# EasyEDA Pro project EasyEda_Node.eprj

# Schematic Schematic1
Board Name: Board1; Create Date: 2025-04-09; Page Name: P1; Project Name: New Project_2025-04-09_20-26-49; Schematic Name: Schematic1; Update Date: 2025-04-21; Company: EasyEDA.com; Page Size: A4; Version: V1.0
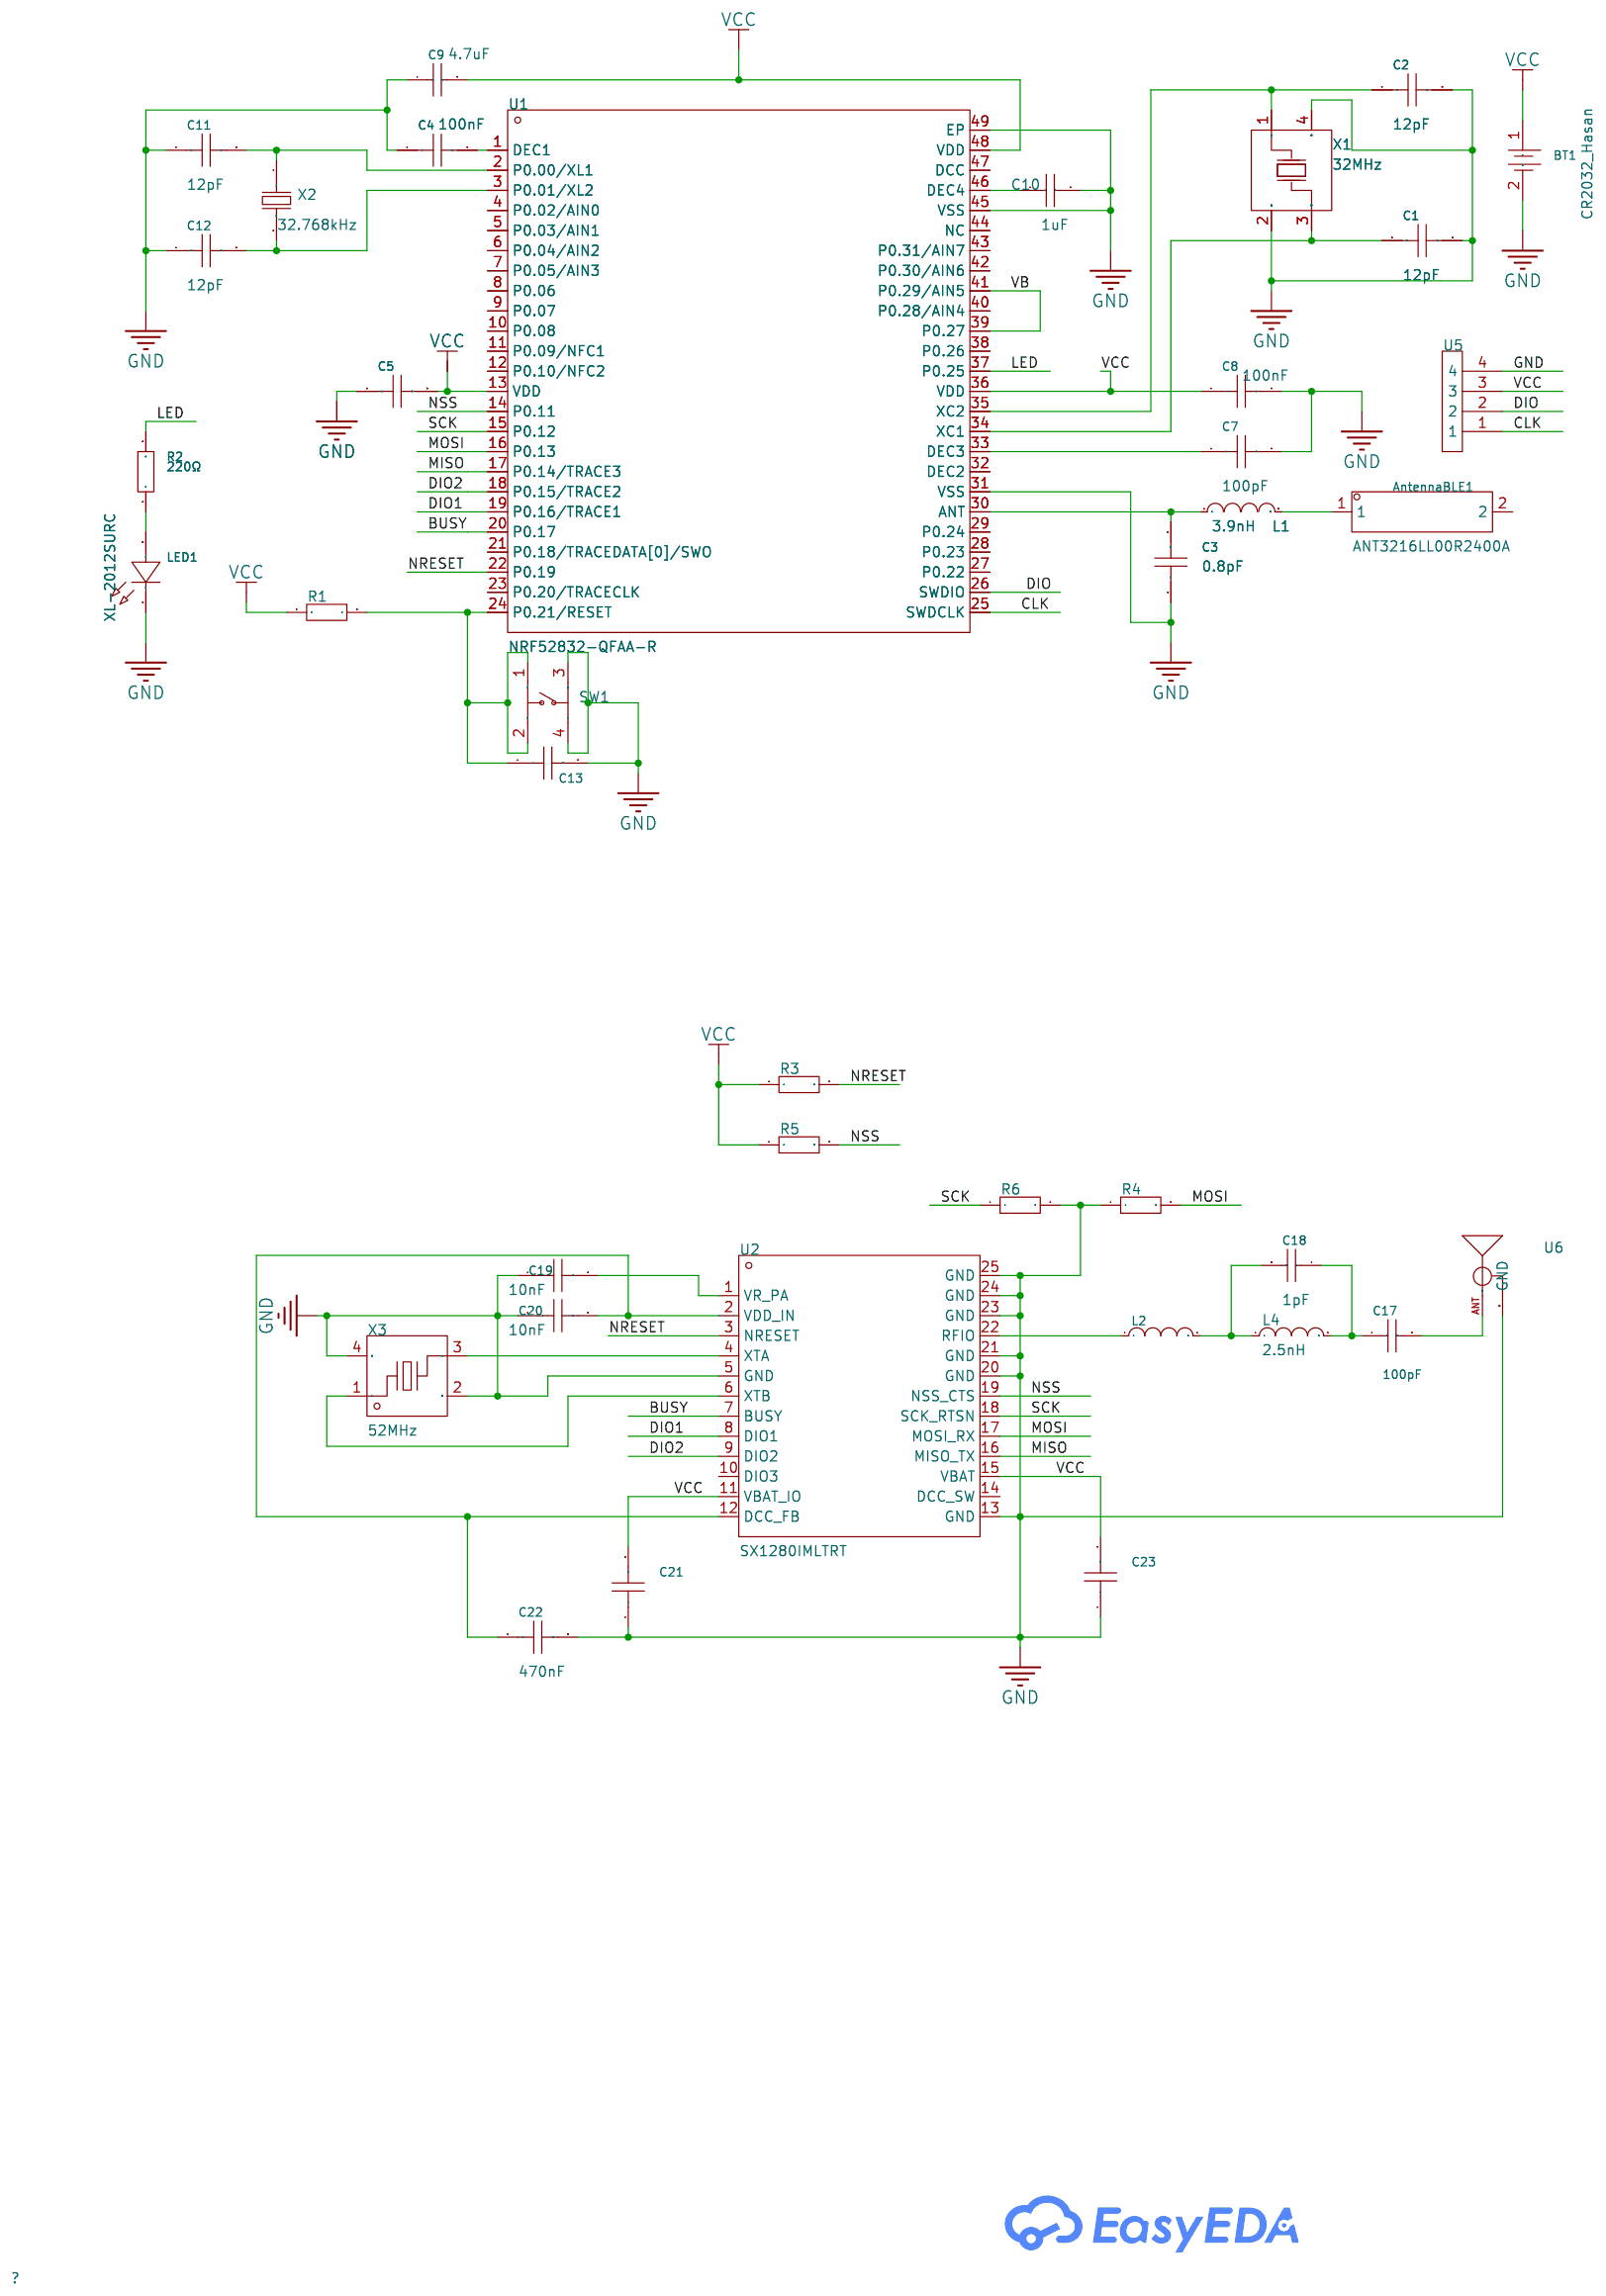
[diagram p0: schematic sheet]

## Parts
AntennaBLE1  ANT3216LL00R2400A  [ANT-SMD_L3.2-W1.6]
BT1  CR2032_Hasan  [CR2032_Hasan]
C1  12pF  [C0603]
C2  12pF  [C0603]
C3  0.8pF  [C0603]
C4  100nF  [C0603]
C5  100nF  [C0402]
C7  100pF  [C0603]
C8  100nF  [C0603]
C9  4.7uF  [C0603]
C10  1uF  [C0603]
C11  12pF  [C0603]
C12  12pF  [C0603]
C13  100nF  [C0402]
C17  100pF  [C0402]
C18  1pF  [C0402]
C19  10nF  [C0402]
C20  10nF  [C0402]
C21  100nF  [C0402]
C22  470nF  [C0402]
C23  100nF  [C0402]
L1  3.9nH  [L0402-RD]
L2  3nH  [L0402]
L4  2.5nH  [L0402]
LED1  XL-2012SURC  [LED0805-RD_RED]
R1  10kΩ  [R0402]
R2  220Ω  [R0603]
R3  10kΩ  [R0402]
R4  10kΩ  [R0402]
R5  10kΩ  [R0402]
R6  10kΩ  [R0402]
SW1  1TS026A-2300-0553-CT  [SW-SMD_4P-L2.6-W1.6-P0.75-LS3.0]
U1  NRF52832-QFAA-R  [QFN-48_L6.0-W6.0-P0.40-BL-EP3.8]
U2  SX1280IMLTRT  [QFN-24_L4.0-W4.0-P0.50-BL-EP2.6]
U5  -  [pogo_4p_passive_1.27]
U6  -  [Antenna_JLC_Tested]
X1  32MHz  [CRYSTAL-SMD_4P-L3.2-W2.5-BL]
X2  32.768kHz  [CRYSTAL-SMD_L3.2-W1.5]
X3  52MHz  [CRYSTAL-SMD_4P-L3.2-W2.5-BL]

## Library data of the parts
AntennaBLE1 = ANT3216LL00R2400A: Antenna Type:芯片天线 Central Frequency:2.45GHz Bandwidth:160MHz Peak Gain:5.05dBi Peak Gain:5.05dBi Polarization Type:Linear Impedance:50Ω Power capacity:1W VSWR:- Operating Temperature:-40℃~+105℃ Operating Temperature:-40℃~+105℃; LCSC Part Name: 无线组件陶瓷芯片天线; Supplier Part: C293767; Manufacturer: YAGEO(国巨); Supplier Footprint: 1206; Datasheet: https://atta.szlcsc.com/upload/public/pdf/source/20181012/C293767_CDE82A2F74DC82A94DB708CB53B68F23.pdf; Supplier: LCSC; Antenna Type: 芯片天线; Central Frequency: 2.45GHz; Bandwidth: 160MHz; Peak Gain: 5.05dBi; Polarization Type: Linear; Impedance: 50Ω; Power capacity: 1W; Operating Temperature: -40℃~+105℃
BT1 = CR2032_Holder: LCSC Part Name: CR2032弯脚电池片铜 3V; Supplier Part: C70373; Manufacturer: Q&amp;J; Supplier Footprint: SMD; JLCPCB Part Class: Extended Part; Datasheet: https://atta.szlcsc.com/upload/public/pdf/source/20160427/1461725216470.pdf; Supplier: LCSC; Connector Type: Battery button; Battery Type: CR2032
C1 C2 C11 C12 = CC0603FRNPO9BN120: Capacitance: Tolerance:±1% Tolerance:±1% Voltage Rated: Temperature Coefficient:; LCSC Part Name: 12pF ±1% 50V; Supplier Part: C519482; Manufacturer: YAGEO(国巨); Supplier Footprint: 0603; Datasheet: https://atta.szlcsc.com/upload/public/pdf/source/20200423/C519482_89049CE53433C44DEC6365B4D6A7EBAA.pdf; Supplier: LCSC; Tolerance: ±1%
C3 = CC0603CRNPO9BNR80: Capacitance: Voltage Rated: Temperature Coefficient:; LCSC Part Name: 0.8pF 50V; Supplier Part: C327165; Manufacturer: YAGEO(国巨); Supplier Footprint: 0603; Datasheet: https://atta.szlcsc.com/upload/public/pdf/source/20181031/C327165_24A4FA1353DDE2A290D154FA51B555EC.pdf; Supplier: LCSC
C4 C8 = CL10B104KB8NNNC: Capacitance: Tolerance:±10% Tolerance:±10% Voltage Rated: Temperature Coefficient:; LCSC Part Name: 100nF ±10% 50V; Supplier Part: C1591; Manufacturer: SAMSUNG(三星); Supplier Footprint: 0603; Datasheet: https://atta.szlcsc.com/upload/public/pdf/source/20160218/1457707763339.pdf; Supplier: LCSC; Tolerance: ±10%
C5 C13 C21 C23 = CC0402KRX7R7BB104: Capacitance: Tolerance:±10% Tolerance:±10% Voltage Rated: Temperature Coefficient:; LCSC Part Name: 100nF ±10% 16V; Supplier Part: C60474; Manufacturer: YAGEO(国巨); Supplier Footprint: 0402; JLCPCB Part Class: Extended Part; Datasheet: https://atta.szlcsc.com/upload/public/pdf/source/20211223/9278FD768280B81DDBEF48FA36411A03.pdf; Supplier: LCSC; Tolerance: ±10%
C7 = CC0603JRNPO9BN101: Capacitance: Tolerance:±5% Tolerance:±5% Voltage Rated: Temperature Coefficient:; LCSC Part Name: 100pF ±5% 50V; Supplier Part: C14665; Manufacturer: YAGEO(国巨); Supplier Footprint: 0603; Datasheet: https://atta.szlcsc.com/upload/public/pdf/source/20181008/C309499_21CC21451B82C39E3D92150FD6B30293.pdf; Supplier: LCSC; Tolerance: ±5%
C9 = CL10A475KP8NNNC: Capacitance: Tolerance:±10% Tolerance:±10% Voltage Rated: Temperature Coefficient:; LCSC Part Name: 4.7uF ±10% 10V; Supplier Part: C1705; Manufacturer: SAMSUNG(三星); Supplier Footprint: 0603; Datasheet: https://atta.szlcsc.com/upload/public/pdf/source/20160218/1457707763339.pdf; Supplier: LCSC; Tolerance: ±10%
C10 = CL10A105KO8NNNC: Capacitance: Tolerance:±10% Tolerance:±10% Voltage Rated: Temperature Coefficient:; LCSC Part Name: 1uF ±10% 16V; Supplier Part: C1592; Manufacturer: SAMSUNG(三星); Supplier Footprint: 0603; Datasheet: https://atta.szlcsc.com/upload/public/pdf/source/20220919/9FBE606BE0D9532D730F292EB26DC5BB.pdf; Supplier: LCSC; Tolerance: ±10%
C17 = GRM1555C1H101JA01D: Capacitance: Tolerance:±5% Tolerance:±5% Voltage Rated: Temperature Coefficient:; LCSC Part Name: 100pF ±5% 50V; Supplier Part: C77177; Manufacturer: muRata(村田); Supplier Footprint: 0402; JLCPCB Part Class: Extended Part; Datasheet: https://atta.szlcsc.com/upload/public/pdf/source/20161108/1478586482814.pdf; Supplier: LCSC; Tolerance: ±5%
C18 = GJM1555C1H1R0WB01D: Capacitance: Voltage Rated: Temperature Coefficient:; LCSC Part Name: 1pF 50V ±0.05pF; Supplier Part: C72134; Manufacturer: muRata(村田); Supplier Footprint: 0402; JLCPCB Part Class: Extended Part; Datasheet: https://atta.szlcsc.com/upload/public/pdf/source/20161108/1478586454732.pdf; Supplier: LCSC
C19 C20 = GRM155R71E103KA01D: Capacitance: Tolerance:±10% Tolerance:±10% Voltage Rated: Temperature Coefficient:; LCSC Part Name: 10nF ±10% 25V; Supplier Part: C77013; Manufacturer: muRata(村田); Supplier Footprint: 0402; Datasheet: https://atta.szlcsc.com/upload/public/pdf/source/20180326/C77013_E333CAB36C7BC33A0F4D36AE4B603ED6.pdf; Supplier: LCSC; Tolerance: ±10%
C22 = GRM155R61A474KE15D: Capacitance: Tolerance:±10% Tolerance:±10% Voltage Rated: Temperature Coefficient:; LCSC Part Name: 470nF ±10% 10V; Supplier Part: C77003; Manufacturer: muRata(村田); Supplier Footprint: 0402; Datasheet: https://atta.szlcsc.com/upload/public/pdf/source/20180326/C77003_446CEA12FBC0B60A315D36ABEF884933.pdf; Supplier: LCSC; Tolerance: ±10%
L1 = SDCL1005C3N9STDFM02: Inductance: Rated Current:- Saturation Current (Isat):- DC Resistance (DCR):- Q @ Freq:- Frequency - Self Resonant:- Ratings:; Supplier Part: C370223; Manufacturer: Sunlord(顺络); Supplier Footprint: 0402; Datasheet: https://atta.szlcsc.com/upload/public/pdf/source/20210916/2389196E6DC4CA1121B2D3610B126F46.pdf; Supplier: LCSC
L2 = LQW15AN3N0B80D: Inductance:3nH Rated Current: Saturation Current (Isat):- DC Resistance (DCR): Ratings:-; Supplier Part: C2041661; Manufacturer: muRata(村田); Supplier Footprint: 0402; JLCPCB Part Class: Extended Part; Datasheet: https://atta.szlcsc.com/upload/public/pdf/source/20210504/828CF85BF1F050871A8563B8C7472C90.pdf; Supplier: LCSC
L4 = LQW15AN2N5C00D: Inductance:2.5nH Rated Current: Saturation Current (Isat):- DC Resistance (DCR): Ratings:-; Supplier Part: C703121; Manufacturer: muRata(村田); Supplier Footprint: 0402; JLCPCB Part Class: Extended Part; Datasheet: https://atta.szlcsc.com/upload/public/pdf/source/20191022/C440248_094C93E028FCF0FA66FA57BC1ADCD3EF.pdf; Supplier: LCSC
LED1 = XL-2012SURC: Emitted Color:Red Power Dissipation:55mW Forward Current:25mA Dominant Wavelength:617nm~621nm Dominant Wavelength:617nm~621nm Peak Wavelength:623nm Lens Color:无色透明透镜 Color Temperature:- Color Temperature:- Viewing Angle:120° Mounting Sytle:Positive post O; Supplier Part: C965812; Manufacturer: XINGLIGHT(成兴光); Supplier Footprint: 0805; Datasheet: https://atta.szlcsc.com/upload/public/pdf/source/20221102/49E1A0A365644091E6270AF1C5E0FE37.pdf; Supplier: LCSC; Emitted Color: Red; Power Dissipation: 55mW; Forward Current: 25mA; Dominant Wavelength: 617nm~621nm; Peak Wavelength: 623nm; Lens Color: 无色透明透镜; Viewing Angle: 120°; Mounting Sytle: Positive post; Operating Temperature: -30℃~+85℃
R1 R4-R6 = RC0402FR-0710KL: Type:Thick Film Resistors Resistance: Tolerance: Power(Watts): Temperature Coefficient: Temperature Coefficient: Overload Voltage (Max): Operating Temperature Range: Operating Temperature Range:; LCSC Part Name: 10kΩ ±1%; Supplier Part: C60490; Manufacturer: YAGEO(国巨); Supplier Footprint: 0402; JLCPCB Part Class: Extended Part; Datasheet: https://atta.szlcsc.com/upload/public/pdf/source/20170606/1496716515432.pdf; Supplier: LCSC; Type: Thick Film Resistors
R2 = 0603WAF2200T5E: Type:Thick Film Resistors Resistance: Tolerance:±1% Tolerance:±1% Power(Watts): Overload Voltage (Max): Temperature Coefficient:±100ppm/℃ Temperature Coefficient:±100ppm/℃ Operating Temperature Range:-55℃~+155℃ Operating Temperature Range:-55℃~+155℃; LCSC Part Name: 220Ω ±1% 100mW 厚膜电阻; Supplier Part: C22962; Manufacturer: UNI-ROYAL(厚声); Supplier Footprint: 0603; Datasheet: https://atta.szlcsc.com/upload/public/pdf/source/20200306/C422600_1E6D84923E4A46A82E41ADD87F860B5C.pdf; Supplier: LCSC; Type: Thick Film Resistors; Tolerance: ±1%; Temperature Coefficient: ±100ppm/℃; Operating Temperature Range: -55℃~+155℃
R3 = RC0402FR-0710KL: Type:Thick Film Resistors Resistance: Tolerance:±1% Tolerance:±1% Power(Watts): Overload Voltage (Max): Temperature Coefficient:±100ppm/℃ Temperature Coefficient:±100ppm/℃ Operating Temperature Range:-55℃~+155℃ Operating Temperature Range:-55℃~+155℃; LCSC Part Name: 厚膜电阻 10kΩ ±1% 62.5mW; Supplier Part: C60490; Manufacturer: YAGEO(国巨); Supplier Footprint: 0402; JLCPCB Part Class: Extended Part; Datasheet: https://atta.szlcsc.com/upload/public/pdf/source/20170925/C131467_1506321478108990263.pdf; Supplier: LCSC; Type: Thick Film Resistors; Tolerance: ±1%; Temperature Coefficient: ±100ppm/℃; Operating Temperature Range: -55℃~+155℃
SW1 = 1TS026A-2300-0553-CT: Circuit:SPST Actuator Style:Round Button Operating Force:230gf Mounting Style:Brick nogging Switch Length:2.6mm Switch Width:1.6mm Switch Height:0.55mm Strike Gundam:不带 Contact Current:50mA Voltage Rating (DC):12V Power Rating:0.6W Insulation Resistance:1; LCSC Part Name: 2.6*1.6*0.55mm 立贴 轻触开关; Supplier Part: C913791; Manufacturer: HYP(鸿源精密); Supplier Footprint: SMD,1.6x2.6mm; JLCPCB Part Class: Extended Part; Datasheet: https://atta.szlcsc.com/upload/public/pdf/source/20210419/C913791_AF3AAAEB1C89AA41BE379EDBB7CBA7E3.pdf; Supplier: LCSC; Circuit: SPST; Actuator Style: Round Button; Operating Force: 230gf; Mounting Style: Brick nogging; Switch Length: 2.6mm; Switch Width: 1.6mm; Switch Height: 0.55mm; Strike Gundam: 不带; Contact Current: 50mA; Voltage Rating (DC): 12V; Power Rating: 0.6W; Insulation Resistance: 100MΩ; Actuator/Cap Color: Black; With Lamp: No; IP Rating: IP68; Pin Style: SMDSplicing; Mechanical Life: 20万次; Operating Temperature: -40℃~+90℃
U1 = NRF52832-QFAA-R: Frequency Range:- Frequency Range:- Interface:I2C,SPI,UART Operating Voltage:1.7V~3.6V Operating Voltage:1.7V~3.6V Applications:蓝牙；General-purposeISM>1GHz Output Power:4dBm Data Rate:2Mbps Current Of Transmitting:5.3mA Sensitivity:-96dBm Receive Current:5; Supplier Part: C77540; Manufacturer: NORDIC; Supplier Footprint: QFN-48-EP(6x6); Datasheet: https://atta.szlcsc.com/upload/public/pdf/source/20191122/C77540_B22384C9419DF4416C7889F27174782C.pdf; Supplier: LCSC; Interface: I2C,SPI,UART; Operating Voltage: 1.7V~3.6V; Applications: 蓝牙；General-purposeISM>1GHz; Output Power: 4dBm; Data Rate: 2Mbps; Current Of Transmitting: 5.3mA; Sensitivity: -96dBm; Receive Current: 5.4mA; Typical Application Frequency: 2.4GHz; Operating Temperature: -40℃~+85℃
U2 = SX1280IMLTRT: Frequency Range:2.4GHz Frequency Range:2.4GHz Interface:SPI,UART Operating Voltage:1.8V~3.7V Operating Voltage:1.8V~3.7V Applications:802.15.4 Output Power:12.5dBm Current Of Transmitting:24mA Sensitivity:-132dBm Receive Current:8.2mA Operating Temperatur; Supplier Part: C125969; Manufacturer: SEMTECH; Supplier Footprint: QFN-24-EP(4x4); Datasheet: https://atta.szlcsc.com/upload/public/pdf/source/20231031/F8C5ACEABB5B70646AFBC205A4D19EEC.pdf; Supplier: LCSC; Frequency Range: 2.4GHz; Interface: SPI,UART; Operating Voltage: 1.8V~3.7V; Applications: 802.15.4; Output Power: 12.5dBm; Current Of Transmitting: 24mA; Sensitivity: -132dBm; Receive Current: 8.2mA; Operating Temperature: -40℃~+85℃
U5 = pogo_4p_passive_1.27
U6 = Antenna_JLC_Tested
X1 = X322532MOB4SI: Crystal Type:SMD crystal oscillator Frequency: Normal temperature Frequency Tolerance:±10ppm Normal temperature Frequency Tolerance:±10ppm External load capacitor: Frequency Stability(Full temperature range):±20ppm Frequency Stability(Full temperature ran; LCSC Part Name: 32MHz ±10ppm 12pF; Supplier Part: C9009; Manufacturer: YXC(扬兴晶振); Supplier Footprint: SMD3225-4P; Datasheet: https://atta.szlcsc.com/upload/public/pdf/source/20240329/19D5F850207469550BEB00D7DFEDBC7A.pdf; Supplier: LCSC; Crystal Type: SMD crystal oscillator; Normal temperature Frequency Tolerance: ±10ppm; Frequency Stability(Full temperature range): ±20ppm
X2 = FC31M2-32.768-NTLNNDTL: Crystal Type:贴片晶振 Frequency: Normal temperature Frequency Tolerance:±10ppm Normal temperature Frequency Tolerance:±10ppm External load capacitor: Frequency Stability(Full temperature range):±10ppm Frequency Stability(Full temperature range):±10ppm Equival; LCSC Part Name: 32.768kHz ±10ppm 12.5pF; Supplier Part: C5120559; Manufacturer: HCI(杭晶); Supplier Footprint: SMD3215-2P; Datasheet: https://atta.szlcsc.com/upload/public/pdf/source/20220525/2E044CF849361D91E29045F083201687.pdf; Supplier: LCSC; Crystal Type: 贴片晶振; Normal temperature Frequency Tolerance: ±10ppm; Frequency Stability(Full temperature range): ±10ppm
X3 = SX3B52.000F1010F30: Crystal Type:贴片晶振 Frequency:52MHz Normal temperature Frequency Tolerance:±10ppm Normal temperature Frequency Tolerance:±10ppm External load capacitor: Frequency Stability(Full temperature range):±30ppm Frequency Stability(Full temperature range):±30ppm Eq; LCSC Part Name: 52MHz ±10ppm 10pF; Supplier Part: C7302019; Manufacturer: SCTF(星通时频); Supplier Footprint: SMD3225-4P; Datasheet: https://atta.szlcsc.com/upload/public/pdf/source/20230613/B877A30A0AA8EF1805C45A9E5426997D.pdf; Supplier: LCSC; Crystal Type: 贴片晶振; Normal temperature Frequency Tolerance: ±10ppm; Frequency Stability(Full temperature range): ±30ppm; Equivalent Series Resistance (ESR): 30Ω

## Nets
GND: BT1.2 C1.2 C2.2 C3.1 C4.1 C5.1 C7.2 C8.2 C9.1 C10.2 C11.1 C12.1 C13.2 C19.1 C20.1 C21.1 C22.2 C23.1 LED1.1(K) R4.1 R6.2 SW1.3 SW1.4 U1.31(VSS) U1.45(VSS) U1.49(EP) U2.5(GND) U2.13(GND) U2.20(GND) U2.21(GND) U2.23(GND) U2.24(GND) U2.25(GND) U5.4 U6.GND X1.2(GND) X1.4(GND) X3.2(GND) X3.4(GND)
VCC: BT1.1 C5.2 C8.1 C9.2 C21.2 C23.2 R1.1 R3.1 R5.1 U1.13(VDD) U1.36(VDD) U1.48(VDD) U2.11(VBAT_IO) U2.15(VBAT) U5.3
BUSY: U1.20(P0.17) U2.7(BUSY)
CLK: U1.25(SWDCLK) U5.1
DIO: U1.26(SWDIO) U5.2
DIO1: U1.19(P0.16/TRACE1) U2.8(DIO1)
DIO2: U1.18(P0.15/TRACE2) U2.9(DIO2)
LED: R2.2 U1.37(P0.25)
MISO: U1.17(P0.14/TRACE3) U2.16(MISO_TX)
MOSI: R4.2 U1.16(P0.13) U2.17(MOSI_RX)
NRESET: R3.2 U1.22(P0.19) U2.3(NRESET)
NSS: R5.2 U1.14(P0.11) U2.19(NSS_CTS)
SCK: R6.1 U1.15(P0.12) U2.18(SCK_RTSN)
VB: U1.39(P0.27) U1.41(P0.29/AIN5)
$1N1932: C12.2 U1.3(P0.01/XL2) X2.2
$1N1933: C4.2 U1.1(DEC1)
$1N1935: C11.2 U1.2(P0.00/XL1) X2.1
$1N1939: LED1.2(A) R2.1
$1N1940: C13.1 R1.2 SW1.1 SW1.2 U1.24(P0.21/RESET)
$1N1942: AntennaBLE1.1 L1.2
$1N1943: C10.1 U1.46(DEC4)
$1N1947: C7.1 U1.33(DEC3)
$1N1949: C2.1 U1.35(XC2) X1.1(OSC1)
$1N1952: L2.1 U2.22(RFIO)
$1N1953: C17.1 C18.1 L4.2
$1N1984: U2.4(XTA) X3.3
$1N1985: U2.6(XTB) X3.1
$1N2002: C1.1 U1.34(XC1) X1.3(OSC2)
$1N2004: C3.2 L1.1 U1.30(ANT)
$1N2009: C19.2 U2.1(VR_PA)
$1N2010: C20.2 C22.1 U2.2(VDD_IN) U2.12(DCC_FB)
$1N2029: C17.2 U6.ANT(SIGNAL)
$1N2030: C18.2 L2.2 L4.1

Not connected (* = marked no-connect by the designer): AntennaBLE1 2; U1 4(P0.02/AIN0) 5(P0.03/AIN1) 6(P0.04/AIN2) 7(P0.05/AIN3) 8(P0.06) 9(P0.07) 10(P0.08) 11(P0.09/NFC1) 12(P0.10/NFC2) 21(P0.18/TRACEDATA[0]/SWO) 23(P0.20/TRACECLK) 27(P0.22) 28(P0.23) 29(P0.24) 32(DEC2) 38(P0.26) 40(P0.28/AIN4) 42(P0.30/AIN6) 43(P0.31/AIN7) 44(NC) 47(DCC); U2 10(DIO3) 14(DCC_SW)

# Board PCB1
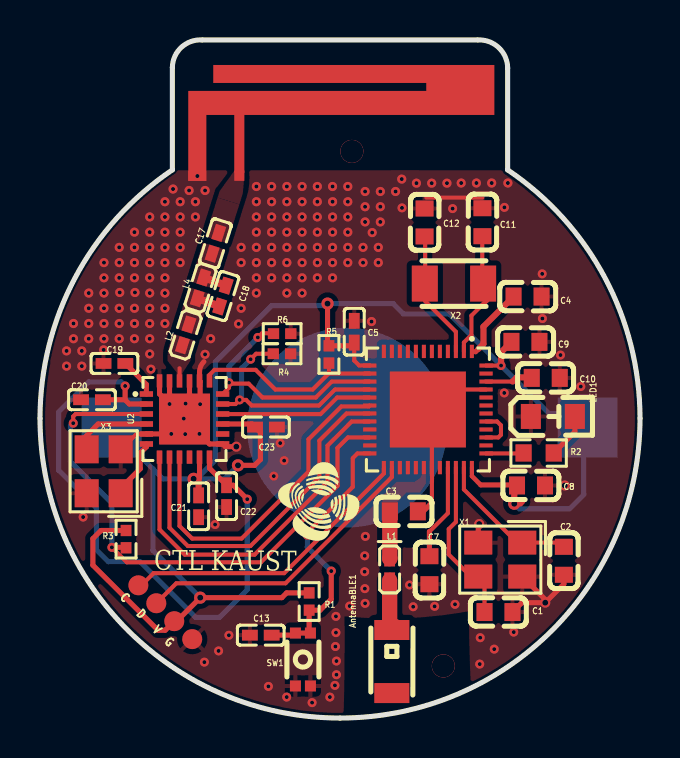
[diagram p1: board, top side]
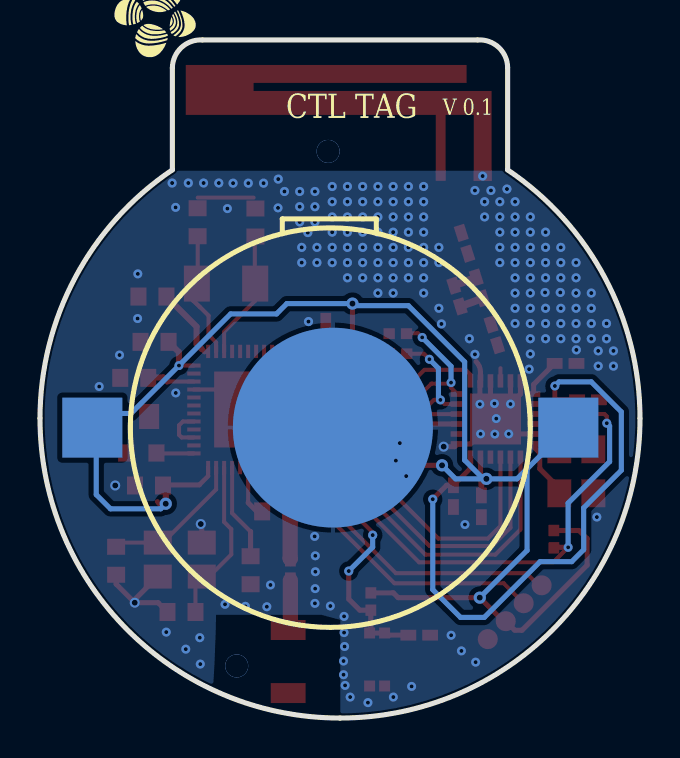
[diagram p2: board, bottom side, seen from below]

Outline 30 x 33.94 mm; copper layers: Top Layer, Bottom Layer. Coordinates in mm from the lower left corner of the outline.
Outline path: 0,15 arc(1.76,22.05) 6.62,27.44 6.62,32.56 arc(7.07,33.58) 8.12,33.94 21.88,33.94 arc(22.93,33.56) 23.38,32.54 23.38,27.44 arc(28.24,22.05) 30,15 arc(25.61,4.39) 15,0 arc(4.39,4.39) 0,15
Stack: Top Layer 0.035mm / Dielectric1 1.51mm FR4 er 4.5 / Bottom Layer 0.035mm

## Design rules (mm)
template: Custom Config
spacing copperThickness1oz (default): track to track 0.102, other pairs 0.152 to 0.279
spacing copperThickness2oz: track to track 0.203, other pairs 0.152 to 0.3
track width copperThickness1oz (default): min 0.127, default 0.254, max 2.54
track width copperThickness2oz: min 0.203, default 0.254, max 2.54
differential pair differentialPair (default): width min 0.127, default 0.254, max 2.54; gap min 0.152, default 0.152
via viaSize (default): diameter min 0.432, default 0.61, max 10; hole min 0.191, default 0.305, max 6.299
net GND uses Antenna
pour e1770 uses Antenna

## Placement (name value [footprint] x y rotation side)
AntennaBLE1  ANT3216LL00R2400A  [ANT-SMD_L3.2-W1.6]  17.59 2.83 270 top
BT1  -  [CR2032_Hasan]  15.48 14.54 270 bottom
C1  12pF  [C0603]  22.93 5.31 0 top
C2  12pF  [C0603]  26.19 7.87 270 top
C3  0.8pF  [C0603]  18.19 10.35 180 top
C4  100nF  [C0603]  24.38 21.1 180 top
C5  100nF  [C0402]  15.71 19.34 270 top
C7  100pF  [C0603]  19.47 7.4 270 top
C8  100nF  [C0603]  24.55 11.64 0 top
C9  4.7uF  [C0603]  24.27 18.83 180 top
C10  1uF  [C0603]  25.29 17.03 0 top
C11  12pF  [C0603]  22.12 24.82 270 top
C12  12pF  [C0603]  19.23 24.81 270 top
C13  100nF  [C0402]  11.04 4.15 180 top
C17  100pF  [C0402]  8.77 23.76 72.5 top
C18  1pF  [C0402]  9.15 21.12 252.5 top
C19  10nF  [C0402]  3.72 17.75 0 top
C20  10nF  [C0402]  2.6 15.93 0 top
C21  100nF  [C0402]  7.93 10.6 90 top
C22  470nF  [C0402]  9.33 11.11 270 top
C23  100nF  [C0402]  11.3 14.57 180 top
L1  3.9nH  [L0402-RD]  17.48 7.44 270 top
L2  3nH  [L0402]  7.28 19.18 72.5 top
L4  2.5nH  [L0402]  8.02 21.53 72.5 top
LED1  XL-2012SURC  [LED0805-RD_RED]  25.64 15.1 0 top
R1  10kΩ  [R0402]  13.46 5.83 270 top
R2  220Ω  [R0603]  24.93 13.27 180 top
R3  10kΩ  [R0402]  4.3 8.95 270 top
R4  10kΩ  [R0402]  12.1 18.24 180 top
R5  10kΩ  [R0402]  14.45 18.2 270 top
R6  10kΩ  [R0402]  12.11 19.24 0 top
SW1  1TS026A-2300-0553-CT  [SW-SMD_4P-L2.6-W1.6-P0.75-LS3.0]  13.15 2.93 270 top
U1  NRF52832-QFAA-R  [QFN-48_L6.0-W6.0-P0.40-BL-EP3.8]  19.39 15.44 180 top
U2  SX1280IMLTRT  [QFN-24_L4.0-W4.0-P0.50-BL-EP2.6]  7.23 14.97 270 top
U5  -  [pogo_4p_passive_1.27]  6.26 5.3 45 top
U6  -  [Antenna_JLC_Tested]  7.41 26.89 0 top
X1  32MHz  [CRYSTAL-SMD_4P-L3.2-W2.5-BL]  23.01 7.93 180 top
X2  32.768kHz  [CRYSTAL-SMD_L3.2-W1.5]  20.7 21.75 180 top
X3  52MHz  [CRYSTAL-SMD_4P-L3.2-W2.5-BL]  3.18 12.35 90 top

## Footprints (pads in the part's own frame, mm; a bottom-side part is the same pattern mirrored in y, then rotated)
ANT-SMD_L3.2-W1.6
  rect 1x1.75 smd: 1(-1.578,0) 2(1.578,0)
Antenna_JLC_Tested
  rect 0.5x0.1 smd: ANT(2.55,0.45)
  rect 0.9x0.5 smd: GND(0.45,0.25)
C0402
  rect 0.79x0.54 smd: 1(-0.545,0) 2(0.545,0)
C0603
  rect 0.8x0.9 smd: 1(-0.7,0) 2(0.7,0)
CR2032_Hasan
  rect 3x3 smd: 1(0,-11.9) 1(0,11.9)
  round 10 smd: 2(0,0.127)
CRYSTAL-SMD_4P-L3.2-W2.5-BL
  rect 1.4x1.2 smd: 1(-1.1,-0.85) 2(1.1,-0.85) 3(1.1,0.85) 4(-1.1,0.85)
CRYSTAL-SMD_L3.2-W1.5
  rect 1.3x1.8 smd: 1(-1.458,0) 2(1.458,0)
L0402
  rect 0.79x0.54 smd: 1(-0.545,0) 2(0.545,0)
L0402-RD
  rect 0.79x0.54 smd: 1(-0.545,0) 2(0.545,0)
LED0805-RD_RED
  rect 1x1.25 smd: 1(-1.1,0) 2(1.1,0)
pogo_4p_passive_1.27
  round 1 smd: 1(0,1.905) 2(0,0.635) 3(0,-0.635) 4(0,-1.905)
QFN-24_L4.0-W4.0-P0.50-BL-EP2.6
  rect 0.28x0.665 smd: 1(-1.25,-1.907) 2(-0.75,-1.907) 3(-0.25,-1.907) 4(0.25,-1.907) 5(0.75,-1.907) 6(1.25,-1.907) 13(1.25,1.907) 14(0.75,1.907) 15(0.25,1.907) 16(-0.25,1.907) 17(-0.75,1.907) 18(-1.25,1.907)
  rect 0.665x0.28 smd: 7(1.907,-1.25) 8(1.907,-0.75) 9(1.907,-0.25) 10(1.907,0.25) 11(1.907,0.75) 12(1.907,1.25) 19(-1.907,1.25) 20(-1.907,0.75) 21(-1.907,0.25) 22(-1.907,-0.25) 23(-1.907,-0.75) 24(-1.907,-1.25)
  rect 2.55x2.55 smd: 25(0,0)
QFN-48_L6.0-W6.0-P0.40-BL-EP3.8
  rect 0.2x0.665 smd: 1(-2.2,-2.908) 2(-1.8,-2.908) 3(-1.4,-2.908) 4(-1,-2.908) 5(-0.6,-2.908) 6(-0.2,-2.908) 7(0.2,-2.908) 8(0.6,-2.908) 9(1,-2.908) 10(1.4,-2.908) 11(1.8,-2.908) 12(2.2,-2.908) 25(2.2,2.908) 26(1.8,2.908) 27(1.4,2.908) 28(1,2.908) 29(0.6,2.908) 30(0.2,2.908) 31(-0.2,2.908) 32(-0.6,2.908) 33(-1,2.908) 34(-1.4,2.908) 35(-1.8,2.908) 36(-2.2,2.908)
  rect 0.665x0.2 smd: 13(2.908,-2.2) 14(2.908,-1.8) 15(2.908,-1.4) 16(2.908,-1) 17(2.908,-0.6) 18(2.908,-0.2) 19(2.908,0.2) 20(2.908,0.6) 21(2.908,1) 22(2.908,1.4) 23(2.908,1.8) 24(2.908,2.2) 37(-2.908,2.2) 38(-2.908,1.8) 39(-2.908,1.4) 40(-2.908,1) 41(-2.908,0.6) 42(-2.908,0.2) 43(-2.908,-0.2) 44(-2.908,-0.6) 45(-2.908,-1) 46(-2.908,-1.4) 47(-2.908,-1.8) 48(-2.908,-2.2)
  rect 3.8x3.8 smd: 49(0,0)
R0402
  rect 0.566x0.54 smd: 1(-0.433,0) 2(0.433,0)
R0603
  rect 0.806x0.864 smd: 1(-0.753,0) 2(0.753,0)
SW-SMD_4P-L2.6-W1.6-P0.75-LS3.0
  rect 0.55x0.55 smd: 1(-1.325,0.375) 2(-1.325,-0.375) 3(1.325,0.375) 4(1.325,-0.375)

## Nets
As in the schematic.

Pads without a net: AntennaBLE1 2; U1 4 5 6 7 8 9 10 11 12 21 23 27 28 29 32 38 40 42 43 44 47; U2 10 14

## Via types
v1: diameter 1.152, hole 1.152, Top Layer to Bottom Layer, 2 vias
v2: diameter 0.457, hole 0.203, Top Layer to Bottom Layer, 144 vias
v3: diameter 0.45, hole 0.2, Top Layer to Bottom Layer, 53 vias
v4: diameter 0.5, hole 0.3, Top Layer to Bottom Layer, 4 vias
v5: diameter 0.61, hole 0.305, Top Layer to Bottom Layer, 5 vias
v6: diameter 0.45, hole 0.201, Top Layer to Bottom Layer, 2 vias

## Routing (per net, layer and track width the routed paths; a pad name or vN(x,y) marks a point on that pad's centre or on a via; arc(x,y) is an arc through that point)
GND: length 33.7
  Top Layer w0.203: 19.32,26.05 22.11,26.05 ; U1.45 20.39,16.44 19.89,15.94 20.21,15.63 20.21,15.44 ; 3.96,13.35 4.82,14.22 U2.5 ; 19.59,10.78 19.59,11.83 19.6,11.83 19.6,11.94 arc(19.6,11.97) 19.6,12 arc(19.6,12.02) 19.6,12.04 19.6,12.17 19.59,12.17 U1.31 19.59,15.25 U1.49
  Top Layer w0.254: v3(7.19,14.99) 7.19,14.85 v3(6.56,14.22) 5.32,14.22 U2.5 ; v3(7.19,14.99) 7.42,15.22 7.48,15.22 ; v3(7.19,14.99) 6.48,15.7 v3(6.48,15.72) ; v3(7.19,14.99) 7.95,14.22 v3(7.97,14.22) 8.48,13.72 U2.13 9.27,13.58 v4(9.82,13.58) ; X1.2 21.91,9.67 v4(21.96,9.71) ; U2.21 7.48,15.22 ; 7.48,15.22 7.51,15.22 v3(8.01,15.71) 8.01,16.85 U2.20 7.98,17.31 arc(8.03,17.6) 8.19,17.84 ; v4(25.26,5.78) 26.19,6.71 C2.2 ; v4(25.26,5.78) 25.26,5.93 X1.4 ; v4(25.26,5.78) 24.09,5.78 23.63,5.31 ; C3.1 19.16,10.35 19.59,10.78 ; U2.23 6.48,15.72 5.98,16.22 U2.24
  vias: v2(1.33,18.38) v2(1.33,17.62) v2(1.67,19.75) v2(1.67,18.99) v2(2.09,18.38) v2(2.09,17.62) v2(2.44,21.27) v2(2.44,20.51) v2(2.44,19.75) v2(2.44,18.99) v2(3.2,22.8) v2(3.2,22.04) v2(3.2,21.27) v2(3.2,20.51) v2(3.2,19.75) v2(3.2,18.99) v2(3.18,18.43) v2(3.96,23.56) v2(3.96,22.8) v2(3.96,22.04) v2(3.96,20.51) v2(3.96,19.75) v2(3.96,18.99) v2(3.99,21.3) v2(4.72,24.32) v2(4.72,23.56) v2(4.72,22.8) v2(4.72,22.04) v2(4.75,21.3) v2(4.72,20.51) v2(4.72,19.75) v2(4.72,18.99) v2(5.48,25.08) v2(5.48,24.32) v2(5.48,23.56) v2(5.48,22.8) v2(5.48,22.04) v2(5.48,21.27) v2(5.48,20.51) v2(5.48,19.75) v2(5.48,18.99) v2(5.48,18.23) v2(5.54,17.46) v2(6.25,25.85) v2(6.25,25.08) v2(6.25,24.32) v2(6.25,23.56) v2(6.25,22.8) v2(6.25,22.04) v2(6.25,21.27) v2(6.25,20.51) v2(6.25,19.75) v2(6.65,26.48) v2(7.01,25.85) v2(7.01,25.08) v2(7.01,24.32) v2(7.01,23.56) v2(7.01,22.8) v2(7.45,26.41) v2(7.87,27.13) v2(7.77,25.85) v2(7.77,25.08) v2(8.25,26.41) v2(8.25,18.2) v2(8.53,18.99) v2(9.93,19.73) v2(10.06,23.56) v2(10.06,22.8) v2(10.06,20.51) v2(10.82,26.61) v2(10.82,25.85) v2(10.82,25.08) v2(10.82,24.32) v2(10.82,23.56) v2(10.82,22.8) v2(10.82,22.04) v2(10.82,21.27) v2(11.58,26.61) v2(11.58,25.85) v2(11.58,25.08) v2(11.58,24.32) v2(11.58,23.56) v2(11.58,22.8) v2(11.58,22.04) v2(12.34,26.61) v2(12.34,25.85) v2(12.34,25.08) v2(12.34,24.32) v2(12.34,23.56) v2(12.34,22.8) v2(12.34,22.04) v2(12.34,21.27) v2(13.1,26.61) v2(13.1,25.85) v2(13.1,25.08) v2(13.1,24.32) v2(13.1,23.56) v2(13.1,22.8) v2(13.1,22.04) v2(13.1,21.27) v2(13.87,26.61) v2(13.87,25.85) v2(13.87,25.08) v2(13.87,24.32) v2(13.87,23.56) v2(13.87,22.8) v2(13.87,22.04) v2(14.63,26.61) v2(14.63,25.85) v2(14.63,25.08) v2(14.63,24.32) v2(14.63,23.56) v2(14.63,22.8) v2(14.63,22.04) v2(15.39,26.61) v2(15.39,25.85) v2(15.39,25.08) v2(15.39,24.32) v2(15.39,23.56) v2(15.39,22.8) v2(16.15,23.56) v2(16.15,22.8) v2(16.25,26.36) v2(16.25,25.6) v2(16.25,24.83) v2(16.61,24.3) v2(16.58,19.85) v2(16.91,23.56) v2(16.91,22.8) v2(17.02,26.36) v2(17.02,25.6) v2(17.02,24.83) v2(17.78,26.36) v2(18.09,26.98) v2(18.82,26.77) v2(19.58,26.77) v2(20.35,26.77) v2(21.06,26.78) v2(21.82,26.78) v2(22.58,26.78) v2(23.39,26.78) v3(2.16,10.06) v3(7.26,14.21) v3(7.28,15.74) v3(8.22,2.8) v3(8.75,9.69) v3(8.93,3.36) v3(9.44,4.14) v3(11.42,1.58) v3(11.69,12.11) v3(12.01,13.76) v3(12.21,12.89) v3(12.33,1.05) v3(13.6,0.77) v3(14.49,1.05) v3(14.75,1.64) v3(14.8,5.09) v3(14.8,4.28) v3(14.77,3.58) v3(14.82,2.85) v3(14.82,2.17) v3(15.48,5.61) v3(16.27,9.09) v3(16.23,8.12) v3(16.23,7.32) v3(16.24,6.48) v3(16.25,5.74) v3(18.1,25.54) v3(18.48,6.66) v3(18.66,5.57) v3(19.73,5.59) v3(20.63,25.5) v3(20.75,5.69) v3(22.01,4.02) v3(21.99,2.7) v3(22.71,3.45) v3(23.22,25.56) v3(23.21,16.27) v3(23.69,4.3) v3(25.11,22.23) v3(25.12,20) v3(26.02,18.17) v3(27.04,16.6) v4(26.24,11.64)
VCC: length 86.9
  Top Layer w0.203: 23.83,11.67 C8.1 ; C5.2 15.71,17.9 15.96,17.65 16.48,17.65 U1.13 ; U1.48 v3(23.05,17.64) ; U1.36 21.59,12.11
  Top Layer w0.229: 21.59,12.11 22.04,11.67
  Top Layer w0.254: 22.04,11.67 23.83,11.67 ; C5.2 15.55,18.64 R5.1 14.38,18.7 v5(14.38,20.75) ; v5(9.9,12.65) 10.73,12.65 11.02,12.94 11.02,14.3 C23.2 10.6,14.72 U2.15 ; 24.13,10.83 24.03,10.73 v5(23.71,10.73) ; R1.1 12.33,6.27 12.09,6.03 v5(8.01,6.03) 6.83,4.85 U5.3 6.26,4.39 5.9,4.39 2.64,7.65 2.64,8.98 3.05,9.39 R3.1 ; U2.11 7.98,12.04 7.91,11.97 v5(7.68,11.97)
  Top Layer w0.305: 7.93,11.3 7.93,12 ; v3(23.05,17.64) 23.05,18.31 C9.2 ; v5(23.71,10.73) 23.71,11.5 C8.1
  Bottom Layer w0.254: 5.65,12.48 5.65,8.39 v5(8.01,6.03) ; 5.65,12.48 6.15,11.97 v5(7.68,11.97) 7.83,11.97 ; 5.65,12.48 BT1.1 ; 7.83,11.97 8.77,12.91 8.77,17.83 11.58,20.64 14.28,20.64 v5(14.38,20.75) 17.66,20.75 18.17,20.23 20.47,20.23 v3(23.05,17.64) 25.45,15.25 26.26,15.25 ; 7.83,11.97 9.22,11.97 v5(9.9,12.65) ; 26.26,15.25 26.97,14.54 BT1.1 27.19,14.34 27.19,11.18 26.48,10.47 23.97,10.47 v5(23.71,10.73) ; 26.26,15.25 26.68,15.25
  Bottom Layer w0.406: 26.68,15.25 BT1.1
(no net):
  vias: v1(15.59,28.36) v1(20.17,2.61)
BUSY: length 18.5
  Top Layer w0.203: U2.7 5.98,9.44 7.23,8.18 10.73,8.18 14.38,11.83 14.38,13.63 15.59,14.84 U1.20
CLK: length 14.9
  Top Layer w0.203: U1.25 17.19,12.24 12.21,7.25 5.68,7.25 5.07,6.64 U5.1
DIO: length 14.9
  Top Layer w0.203: 6.81,6.74 U5.2 ; U1.26 17.59,12.06 12.28,6.75 6.81,6.75
DIO1: length 17.7
  Top Layer w0.203: 16.49,15.25 15.33,15.25 13.97,13.89 13.97,12.06 10.52,8.61 7.39,8.61 6.48,9.53 U2.8
DIO2: length 16.9
  Top Layer w0.203: U1.18 16.44,15.6 15.07,15.6 13.42,13.95 13.42,12.33 10.08,8.99 7.61,8.99 6.98,9.61 U2.9
LED: length 1.9
  Top Layer w0.203: 22.3,13.25 24.09,13.25 24.18,13.16
MISO: length 7.7
  Top Layer w0.203: U2.16 9.14,15.21 14.02,15.21 14.86,16.05 16.49,16.05
MOSI: length 11.4
  Top Layer w0.203: U2.17 9.77,15.72 v3(9.98,15.92) 10.3,15.92 10.58,15.64 13.95,15.64 14.75,16.44 U1.16 ; R4.2 10.81,18.24 v6(10.53,17.96)
  Bottom Layer w0.254: v6(10.53,17.96) 10.08,17.51 10.08,16.02 v3(9.98,15.92)
NRESET: length 28.8
  Top Layer w0.203: 16.49,14.05 15.4,14.05 14.87,13.52 14.87,11.62 11.05,7.8 4.34,7.8 v3(3.59,8.54) ; v3(1.66,14.76) 1.66,15.1 1.78,15.22 U2.3
  Top Layer w0.254: v3(3.59,8.54) 4.28,8.54 R3.2
  Bottom Layer w0.254: v3(1.66,14.76) 1.52,14.62 1.52,12.83 3.59,10.76 v3(3.59,8.54)
NSS: length 9.7
  Top Layer w0.203: 14.43,17.25 14.45,17.26 14.45,17.77 ; 14.43,17.25 16.49,17.25 ; 14.43,17.25 13.63,16.44 11.77,16.44 10.78,17.43 8.72,17.43 8.47,17.17 8.47,16.88 U2.19
SCK: length 12.1
  Top Layer w0.203: v6(10.89,19.05) 11.1,19.26 11.65,19.26 R6.1 ; U1.15 14.59,16.84 13.79,16.05 11.13,16.05 10.43,16.74 9.5,16.74 v3(9.45,16.79) 9.45,16.53 U2.18
  Bottom Layer w0.254: v3(9.45,16.79) 9.45,17.61 v6(10.89,19.05)
VB: length 2.1
  Top Layer w0.203: U1.41 22.86,14.84 23.05,14.65 23.05,14.18 22.91,14.05 22.3,14.05
$1N1932: length 6.4
  Top Layer w0.203: 19.35,24.12 19.26,24.03 19.26,20.87 20.79,19.33 U1.3
$1N1933: length 3.7
  Top Layer w0.203: 21.77,18.33 21.59,18.33
  Top Layer w0.254: 21.93,18.48 21.77,18.33
  Top Layer w0.305: 21.93,18.48 22.17,18.73 22.17,19.59 C4.2
$1N1935: length 6.8
  Top Layer w0.203: 22,20.57 22.32,20.89 22.34,20.89 ; 22,20.57 21.57,20.14 21.57,19.18 21.19,18.8 U1.2 ; 22,20.57 22.34,20.89 ; 22.34,20.89 22.34,22.26 22.11,22.49 22.11,24.11 C11.2
$1N1939: length 2.3
  Top Layer w0.254: LED1.2 26.74,14.33 R2.1
$1N1940: length 13.9
  Top Layer w0.203: v2(13.37,9.16) 13.37,9.3 15.64,11.57 15.64,13.01 15.87,13.25 16.49,13.25
  Top Layer w0.254: C13.1 12.67,4.15 SW1.2 SW1.1 13.46,4.32 13.46,5.4 14.01,5.4 14.56,5.95 v2(14.56,7.36)
  Bottom Layer w0.254: v2(14.56,7.36) 13.37,8.55 v2(13.37,9.16)
$1N1942: length 2.6
  Top Layer w0.762: L1.2 17.48,4.47
  Top Layer w1.067: 17.48,4.47 17.64,4.47
$1N1943: length 2.3
  Top Layer w0.203: U1.46 23.63,16.84
  Top Layer w0.305: 24.51,17.05 23.84,17.05 23.63,16.84
$1N1947: length 4.8
  Top Layer w0.203: 19.48,9.34 20.39,10.25 U1.33
  Top Layer w0.254: C7.1 19.47,9.33 19.48,9.34
$1N1949: length 7.3
  Top Layer w0.203: C2.1 25.98,8.78 X1.1 23.86,8.78 21.19,11.44 U1.35
$1N1952: length 0.6
  Top Layer w0.203: 6.98,17.51 U2.22
$1N1953: length 1.2
  Top Layer w0.381: L4.2 C18.1
$1N1984: length 4.1
  Top Layer w0.254: 2.04,13.41 2.04,13.85 2.91,14.72 U2.4
$1N1985: length 3.2
  Top Layer w0.254: U2.6 5.32,13.57 5.01,13.27 5.01,12.48 3.74,11.21
$1N2002: length 8.3
  Top Layer w0.203: U1.34 20.79,9.82 20.44,9.46 20.44,8.19 21.54,7.08 X1.3 22.23,6.77 C1.1
$1N2004: length 2.4
  Top Layer w0.762: L1.1 17.49,7.99 17.49,10.35
$1N2009: length 2
  Top Layer w0.254: U2.1 5.32,16.7 C19.2
$1N2010: length 31.8
  Top Layer w0.254: 4.25,15.93 4.26,15.94 v3(4.26,16.62) ; 4.25,15.93 C20.2 ; 4.25,15.93 4.46,15.72 U2.2 ; U2.12 8.48,12.5 C22.1 9.67,11.65 v2(10.36,10.96)
  Bottom Layer w0.254: v2(10.36,10.96) 10.36,6.43 8.97,5.04 7.79,5.04 5,7.83 3.41,7.83 2.82,8.43 2.82,10.52 0.93,12.4 0.93,15.33 2.44,16.83 4.05,16.83 v3(4.26,16.62)
$1N2030: length 1.2
  Top Layer w0.381: L4.1 C18.2

## Copper pours and planes (outline as drawn; the poured copper is in the pictures)
GND on Top Layer: 24.76,27.18 28.96,21.88 30.45,15.29 28.04,7.04 21.55,1.41 21.48,3.38 21.45,5.35 18.35,5 15.23,5.1 15.23,2.55 15.17,0.01 4.17,4.33 -0.66,15.12 -0.12,16.63 0.67,18.02 4.85,18.2 5.75,17.21 7.62,17.21 8.19,18.05 17.57,27.42 24.3,27.42
GND on Top Layer: -0.36,18 -0.37,17.87 -0.33,17.75 5.2,17.75 5.16,17.62 5.18,17.49 5.46,16.88 6.03,16.51 7.46,16.51 7.98,17.22 8.24,18.05 18.41,26.7 18.79,27.13 19.29,27.42 5.38,27.42 5.04,27.16 4.79,26.81 2.15,24.17 0.29,21.4 -0.36,18.13
$1N1952 on Top Layer: 6.43,19.24 7.74,19.24 7.74,18.21 6.43,18.21
$1N1952 on Top Layer: 6.38,18.09 7.52,18.09 7.52,17.21 6.38,17.21
$1N1953 on Top Layer: 7.53,23.8 9.23,23.8 9.23,21.51 7.53,21.51
$1N2004 on Top Layer: 17.11,11.82 19,11.82 19,10.78 17.11,10.78
$1N2029 on Top Layer: 8.26,26.05 9.97,26.05 9.97,23.77 8.26,23.77
$1N2029 on Top Layer: 8.88,27.42 10.23,27.42 10.23,25.71 8.88,25.71
$1N2030 on Top Layer: 6.79,21.57 8.53,21.57 8.53,19.16 6.79,19.16
GND on Bottom Layer: 14.99,-0.18 4.18,4.29 -0.29,15.1 1.3,21.89 5.59,27.4 24.62,27.4 28.8,21.87 30.27,15.1 27.85,6.85 21.37,1.21 21.26,3.19 21.2,5.17 15.92,5.17 14.98,4.91 14.99,4.9

Small or netless copper shapes (teardrops, artwork), in the pictures only: 4 on Top Layer

## Text on the board
Bottom Silkscreen Layer: V 0.1 | CTL TAG
Top Silkscreen Layer: C   D   V  G | CTL KAUST
